# Altium schematic sheet 0166_VCCINAUX_CPU POWER.SchDoc
size 848 x 558 mm
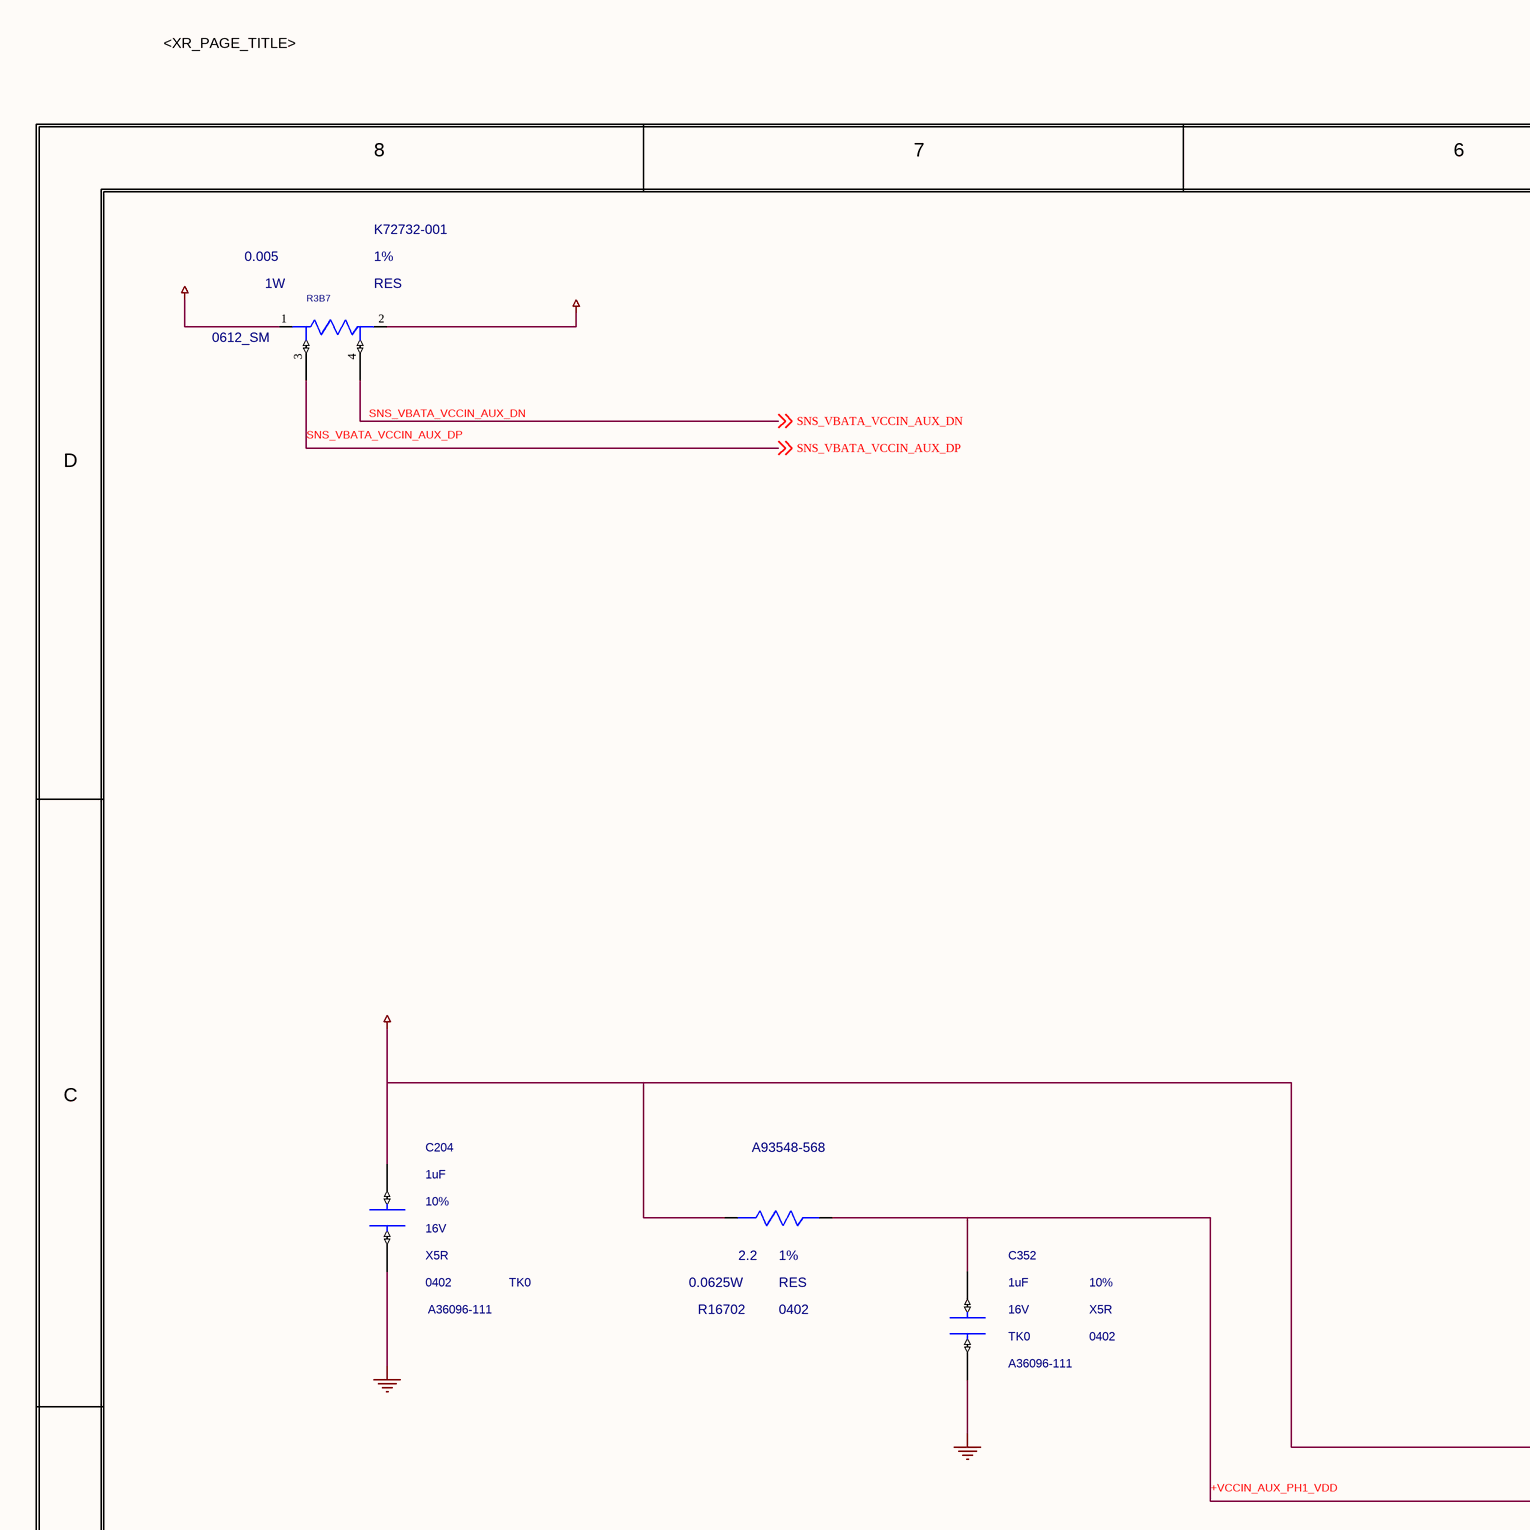
[diagram p0: 0166_VCCINAUX_CPU POWER.SchDoc, top left]
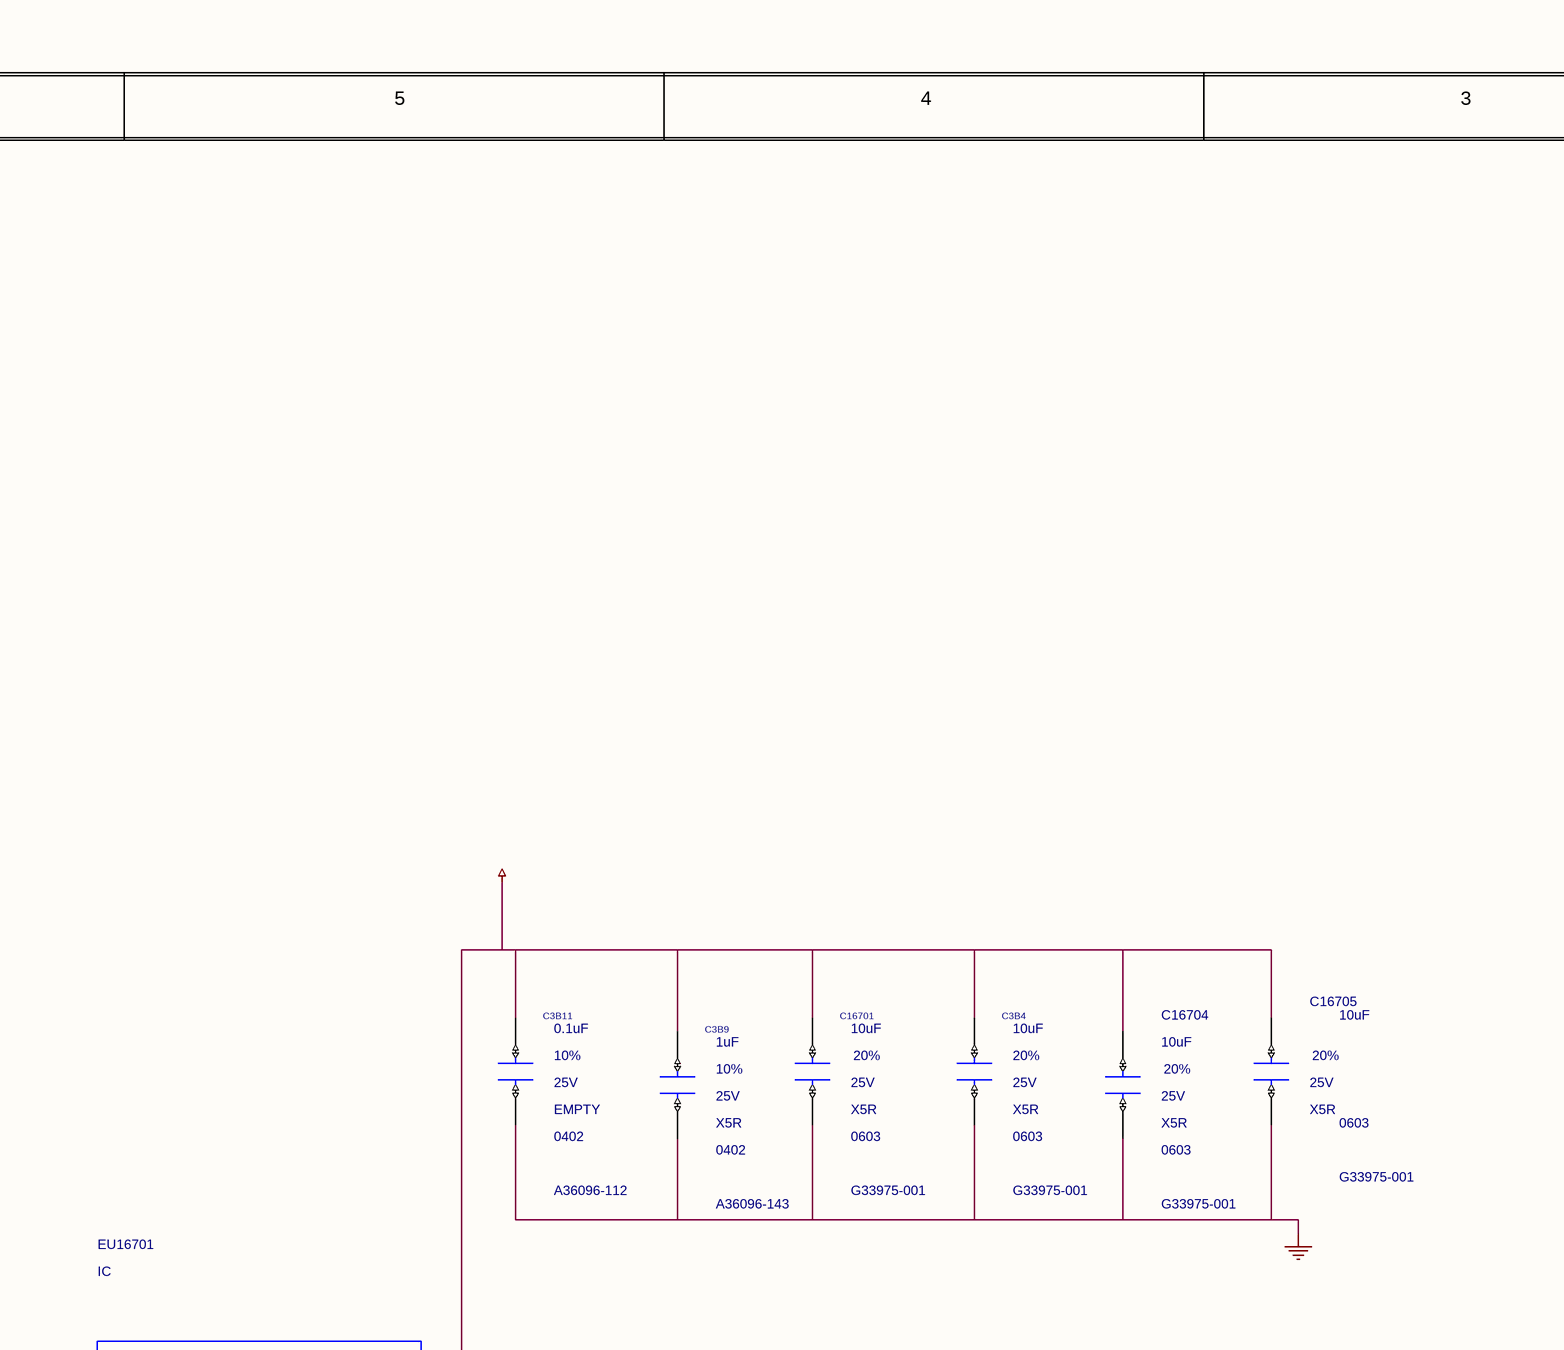
[diagram p1: 0166_VCCINAUX_CPU POWER.SchDoc, top middle]
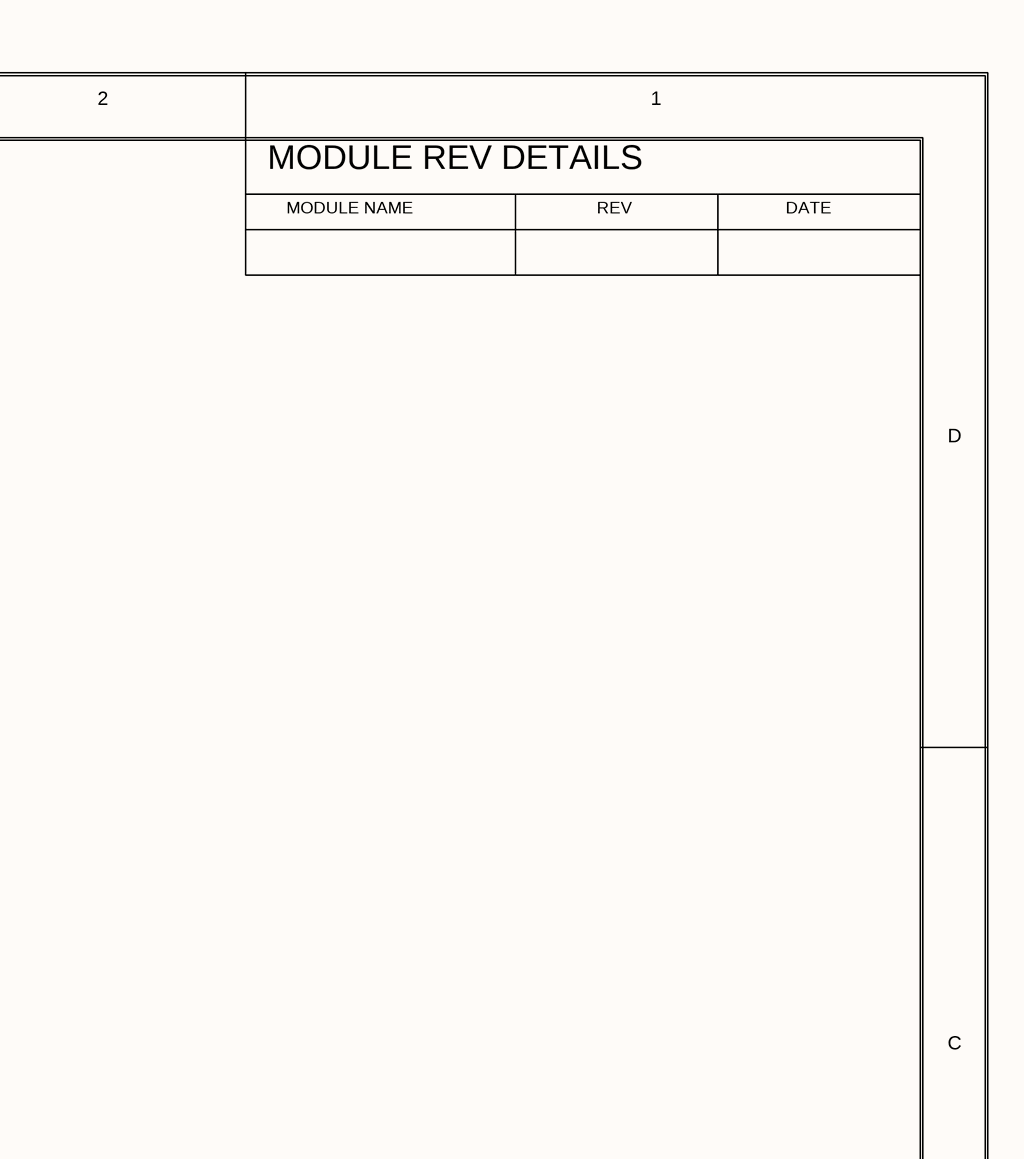
[diagram p2: 0166_VCCINAUX_CPU POWER.SchDoc, top right]
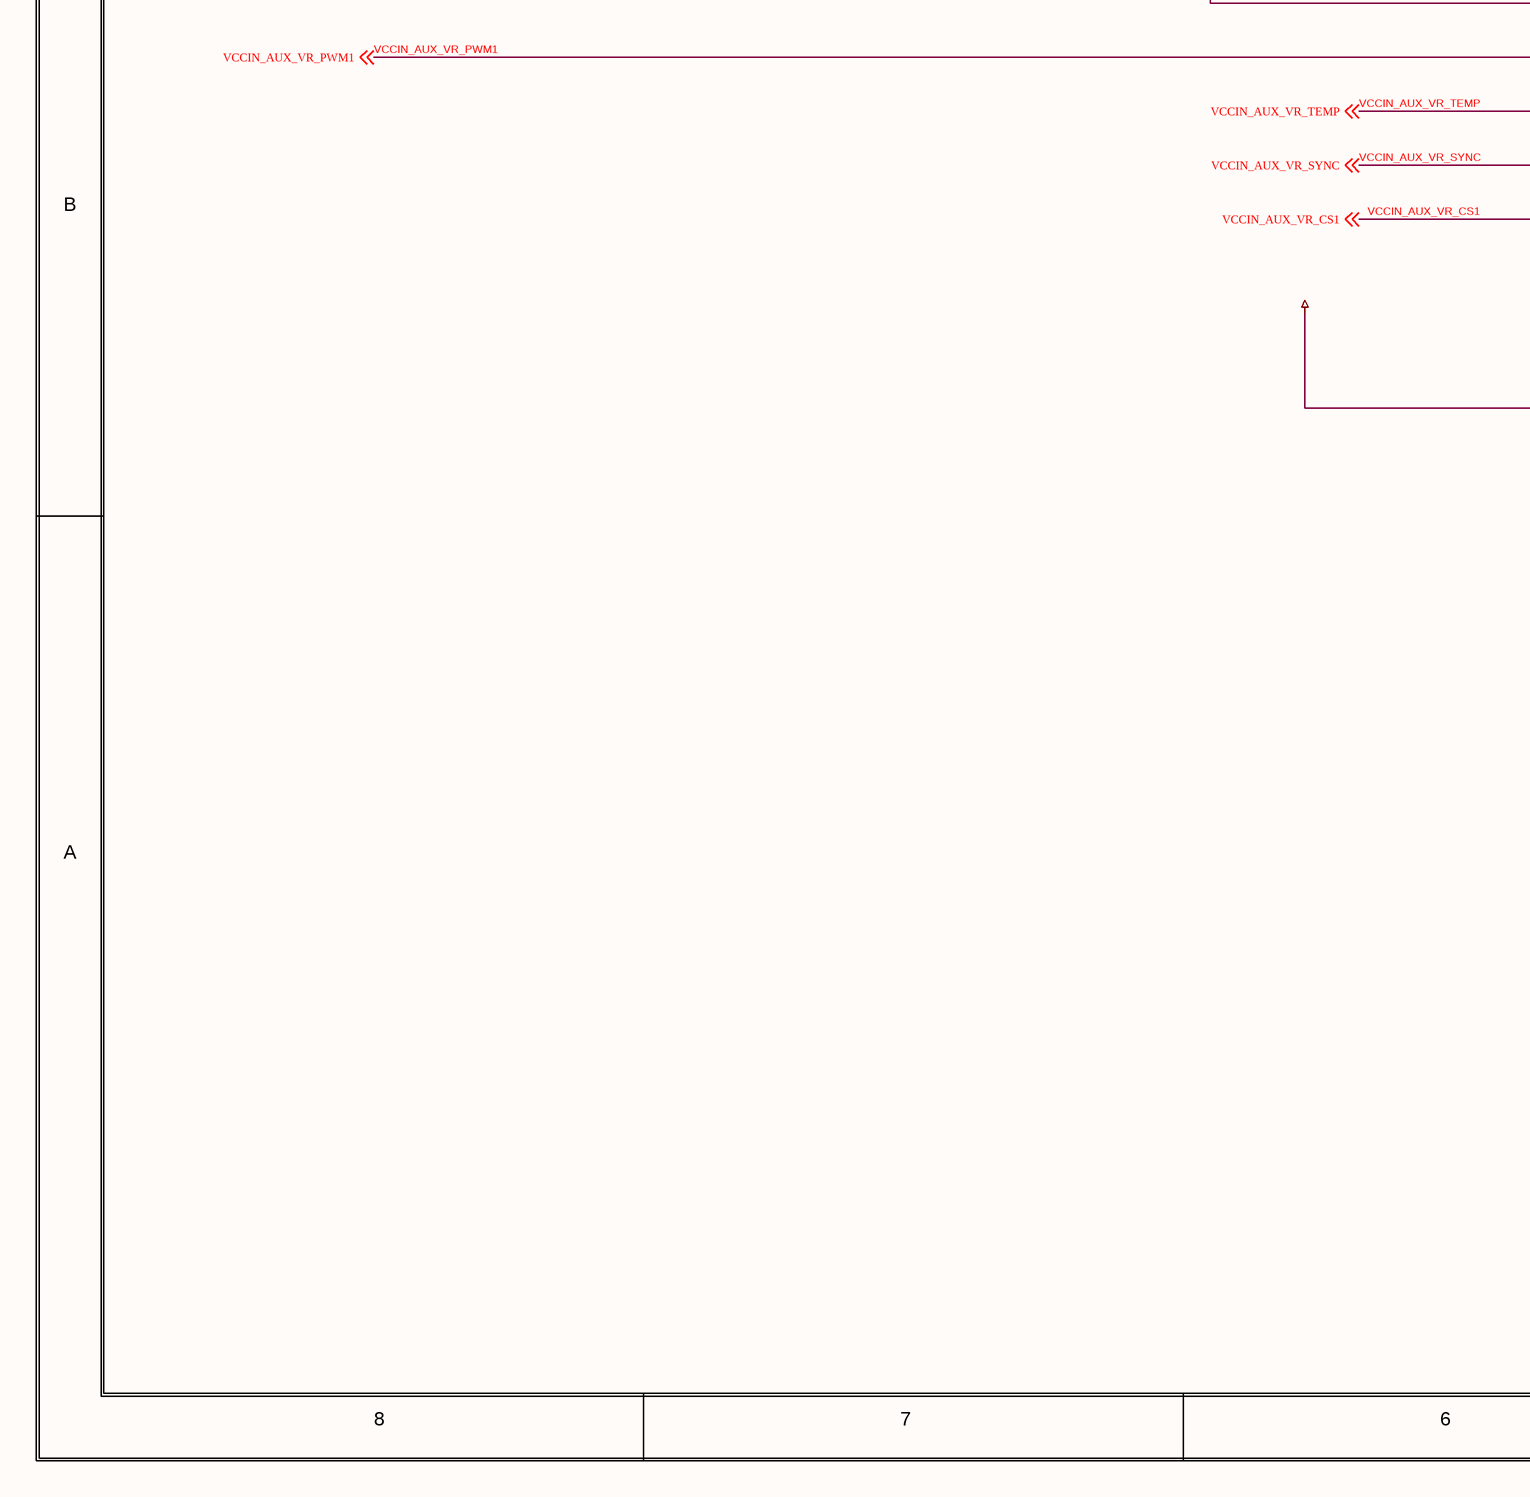
[diagram p3: 0166_VCCINAUX_CPU POWER.SchDoc, bottom left]
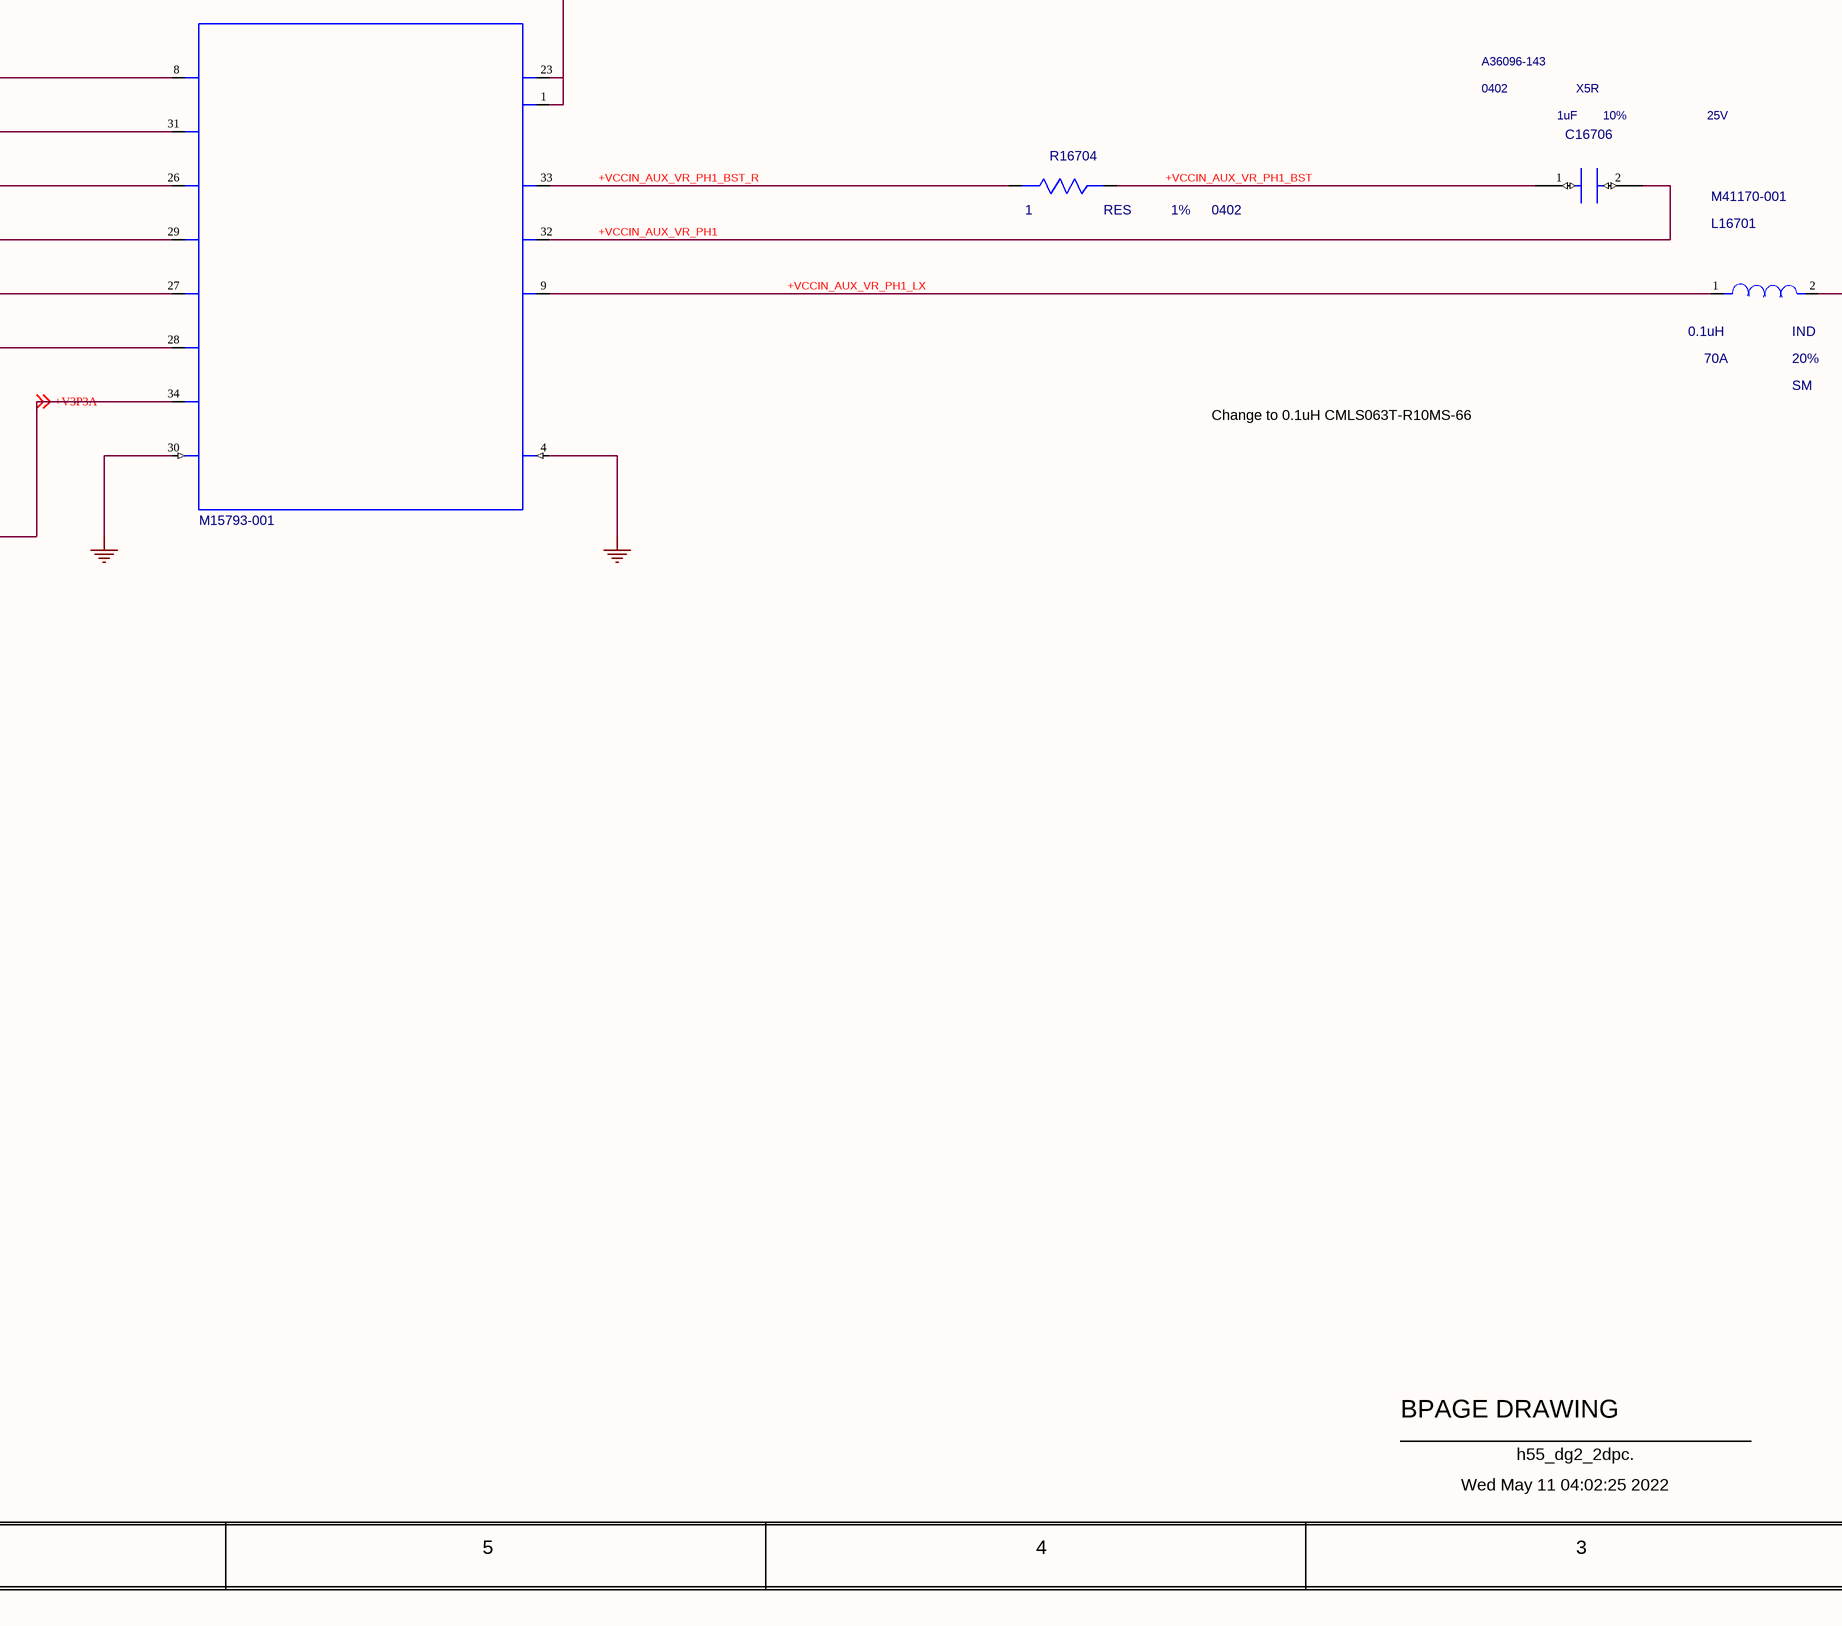
[diagram p4: 0166_VCCINAUX_CPU POWER.SchDoc, bottom middle]
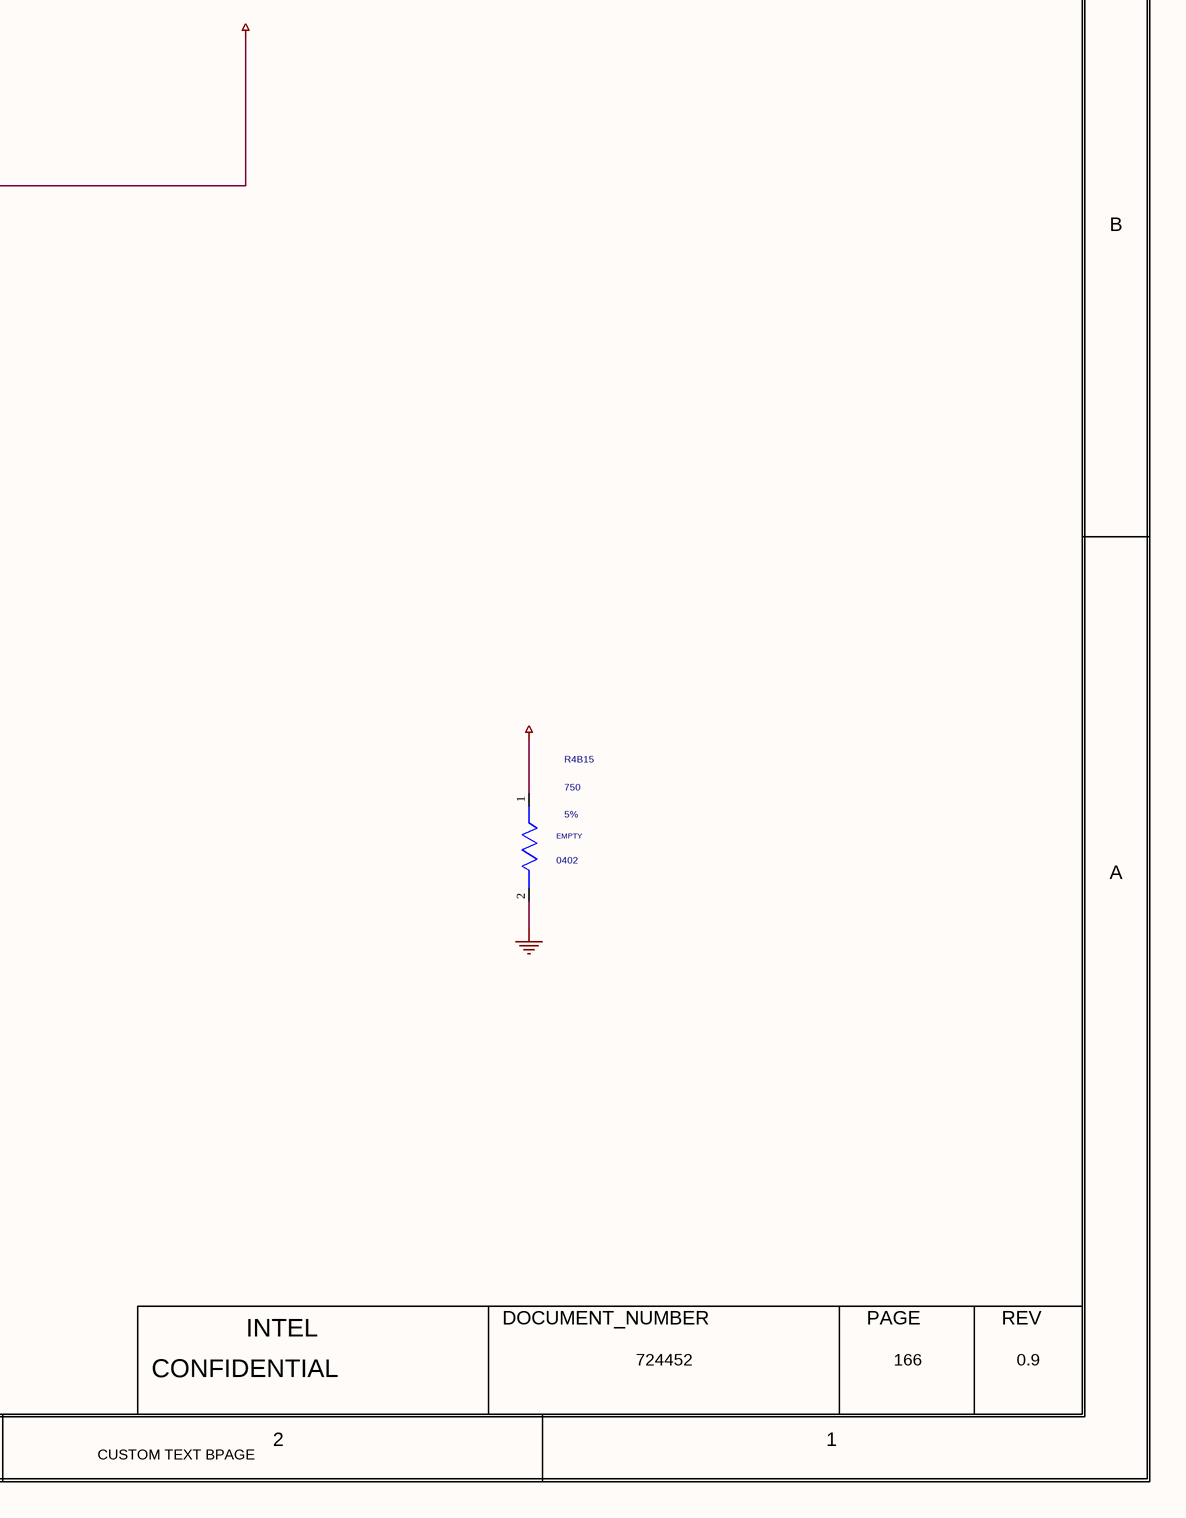
[diagram p5: 0166_VCCINAUX_CPU POWER.SchDoc, bottom right]

## Parts
C3B4  10uF  MATERIAL: X5R  PACK_TYPE: 0603  PART_NUMBER: G33975-001  TOLERANCE: 20%  VOLTAGE: 25V  [CTK2_SM0603_1800X1000_MA]
C3B9  1uF  MATERIAL: X5R  PACK_TYPE: 0402  PART_NUMBER: A36096-143  TOLERANCE: 10%  VOLTAGE: 25V  [CTK2_SM0402_1050X550_MA]
C3B11  0.1uF  MATERIAL: EMPTY  PACK_TYPE: 0402  PART_NUMBER: A36096-112  TOLERANCE: 10%  VOLTAGE: 25V  [CTK0_SM0402_1050X550_MA]
C204  1uF  FP_TECH: TK0  MATERIAL: X5R  PACK_TYPE: 0402  PART_NUMBER: A36096-111  TOLERANCE: 10%  VOLTAGE: 16V  [CTK0_SM0402_1050X550_MA]
C352  1uF  FP_TECH: TK0  MATERIAL: X5R  PACK_TYPE: 0402  PART_NUMBER: A36096-111  TOLERANCE: 10%  VOLTAGE: 16V  [CTK0_SM0402_1050X550_MA]
C16701  10uF  MATERIAL: X5R  PACK_TYPE: 0603  PART_NUMBER: G33975-001  TOLERANCE: 20%  VOLTAGE: 25V  [CTK2_SM0603_1800X1000_MA]
C16704  10uF  MATERIAL: X5R  PACK_TYPE: 0603  PART_NUMBER: G33975-001  TOLERANCE: 20%  VOLTAGE: 25V  [CTK2_SM0603_1800X1000_MA]
C16705  10uF  MATERIAL: X5R  PACK_TYPE: 0603  PART_NUMBER: G33975-001  TOLERANCE: 20%  VOLTAGE: 25V  [CTK2_SM0603_1800X1000_MA]
C16706  1uF  MATERIAL: X5R  PACK_TYPE: 0402  PART_NUMBER: A36096-143  TOLERANCE: 10%  VOLTAGE: 25V  [SMC0402MA]
EU16701  MATERIAL: IC  PART_NUMBER: M15793-001  [CTK1_LCC34_4100X6100_450_DF4P_MA_VR]  (hidden comment: C_MP86959)
L16701  0.1uH  CURRENT: 70A  MATERIAL: IND  PACK_TYPE: SM  PART_NUMBER: M41170-001  TOLERANCE: 20%  [CTK2_SM_7300X6800_MA]
R3B7  0.005  MATERIAL: RES  PACK_TYPE: 0612_SM  PART_NUMBER: K72732-001  TOLERANCE: 1%  WATTAGE: 1W  [CTK0_SMR4_0612_3400X1800_MA_VR]
R4B15  750  MATERIAL: EMPTY  PACK_TYPE: 0402  TOLERANCE: 5%  [SMR0402IA]
R16702  2.2  MATERIAL: RES  PACK_TYPE: 0402  PART_NUMBER: A93548-568  TOLERANCE: 1%  WATTAGE: 0.0625W  [CTK2_SM0402_1100X550_MA]
R16704  1  MATERIAL: RES  PACK_TYPE: 0402  TOLERANCE: 1%  [CTK0_SM0402_1100X550_MA]

## Nets
+V3P3A: C204.1(A) EU16701.8(VDRV) EU16701.34(TEST) R16702.1(A) ; off-sheet +V3P3A
+VBATA: R3B7.1(PWRA)
+VBATA_VCCIN_AUX_VIN: C3B4.1(A) C3B9.1(A) C3B11.1(A) C16701.1(A) C16704.1(A) C16705.1(A) EU16701.1(VIN_1) EU16701.23(VIN_2) R3B7.2(PWRB)
+VCCIN_AUX_PROC: L16701.2(INB) R4B15.1(A)
GND: C3B4.2(B) C3B9.2(B) C3B11.2(B) C204.2(B) C352.2(B) C16701.2(B) C16704.2(B) C16705.2(B) EU16701.4(PGND) EU16701.30(AGND) R4B15.2(B)
+VCCIN_AUX_PH1_VDD: C352.1(A) EU16701.31(VDD) R16702.2(B)
+VCCIN_AUX_VR_PH1: C16706.2(B) EU16701.32(PHASE)
+VCCIN_AUX_VR_PH1_BST: C16706.1(A) R16704.2(B)
+VCCIN_AUX_VR_PH1_BST_R: EU16701.33(BST) R16704.1(A)
+VCCIN_AUX_VR_PH1_LX: EU16701.9(SW) L16701.1(INA)
SNS_VBATA_VCCIN_AUX_DN: R3B7.4(SENB) ; off-sheet SNS_VBATA_VCCIN_AUX_DN
SNS_VBATA_VCCIN_AUX_DP: R3B7.3(SENA) ; off-sheet SNS_VBATA_VCCIN_AUX_DP
VCCIN_AUX_VR_CS1: EU16701.28(CS) ; off-sheet VCCIN_AUX_VR_CS1
VCCIN_AUX_VR_PWM1: EU16701.26(PWM) ; off-sheet VCCIN_AUX_VR_PWM1
VCCIN_AUX_VR_SYNC: EU16701.27(SYNC) ; off-sheet VCCIN_AUX_VR_SYNC
VCCIN_AUX_VR_TEMP: EU16701.29(VTEMP_FLT) ; off-sheet VCCIN_AUX_VR_TEMP

## Notes on the sheet
- <XR_PAGE_TITLE>
- 8
- 7
- 6
- 5
- 4
- 3
- 2
- 1
- MODULE REV DETAILS
- MODULE NAME
- REV
- DATE
- D
- C
- B
- Change to 0.1uH CMLS063T-R10MS-66
- A
- BPAGE DRAWING
- INTEL
- DOCUMENT_NUMBER
- PAGE
- Wed May 11 04:02:25 2022
- h55_dg2_2dpc.
- CONFIDENTIAL
- 724452
- 166
- 0.9
- CUSTOM TEXT BPAGE

## Library data of the parts
C3B4 = C_CAP: CDS_PHYS_PART_NAME: C_CAP_0603-G33975-001,X5R,10UF,25V,20%,TK2,GENERIC; CDS_LMAN_SYM_OUTLINE: -50,50,50,-50; FP_TECH: TK2; IP: GENERIC; ROOM: NONE; OriginalSymbolOrigin: (-50,25); XY: (-9275,4625); VER: 1; ROT: 0; PHYS_PAGE: 166; LOCATION: C3B4; DRAWING: @RVP1_ADL_SB_ADP_S_DDR5_SODIMM_2DPC_LIB.H55_DG2_2DPC(SCH_1):PAGE535; CDS_LIB: c_discrete; VARIANT: ?; PCB Footprint: CTK2_SM0603_1800X1000_MA; CHIPS_PART_NAME: C_CAP; CDS_PART_NAME: C_CAP_0603-G33975-001,X5R,10UF,25V,20%,TK2,GENERIC; CDS_LOCATION: C3B4; ASI_MODEL: G33975-001
C3B9 = C_CAP: CDS_PHYS_PART_NAME: C_CAP_0402-A36096-143,X5R,1UF,25V,10%,TK2,GENERIC; CDS_LMAN_SYM_OUTLINE: -50,50,50,-50; FP_TECH: TK2; IP: GENERIC; ROOM: NONE; OriginalSymbolOrigin: (-50,25); XY: (-9825,4600); VER: 1; ROT: 0; PHYS_PAGE: 166; LOCATION: C3B9; DRAWING: @RVP1_ADL_SB_ADP_S_DDR5_SODIMM_2DPC_LIB.H55_DG2_2DPC(SCH_1):PAGE535; CDS_LIB: c_discrete; VARIANT: ?; PCB Footprint: CTK2_SM0402_1050X550_MA; CHIPS_PART_NAME: C_CAP; CDS_PART_NAME: C_CAP_0402-A36096-143,X5R,1UF,25V,10%,TK2,GENERIC; CDS_LOCATION: C3B9; ASI_MODEL: A36096-143
C3B11 = C_CAP: CDS_PHYS_PART_NAME: C_CAP_0402-A36096-112,EMPTY,0.1UF,25V,10%,TK0,GENERIC; CDS_LMAN_SYM_OUTLINE: -50,50,50,-50; FP_TECH: TK0; IP: GENERIC; ROOM: NONE; OriginalSymbolOrigin: (-50,25); XY: (-10125,4625); VER: 1; ROT: 0; PHYS_PAGE: 166; LOCATION: C3B11; DRAWING: @RVP1_ADL_SB_ADP_S_DDR5_SODIMM_2DPC_LIB.H55_DG2_2DPC(SCH_1):PAGE535; CDS_LIB: c_discrete; VARIANT: ?; PCB Footprint: CTK0_SM0402_1050X550_MA; CHIPS_PART_NAME: C_CAP; CDS_PART_NAME: C_CAP_0402-A36096-112,EMPTY,0.1UF,25V,10%,TK0,GENERIC; CDS_LOCATION: C3B11; ASI_MODEL: A36096-112
C204 = C_CAP: CDS_PHYS_PART_NAME: C_CAP_0402-A36096-111,X5R,1UF,16V,10%,TK0,GENERIC; CDS_LMAN_SYM_OUTLINE: -50,50,50,-50; IP: GENERIC; ROOM: NONE; OriginalSymbolOrigin: (-50,25); XY: (-13325,4450); VER: 1; ROT: 0; PHYS_PAGE: 166; LOCATION: C204; DRAWING: @RVP1_ADL_SB_ADP_S_DDR5_SODIMM_2DPC_LIB.H55_DG2_2DPC(SCH_1):PAGE535; CDS_LIB: c_discrete; VARIANT: ?; PCB Footprint: CTK0_SM0402_1050X550_MA; CHIPS_PART_NAME: C_CAP; CDS_PART_NAME: C_CAP_0402-A36096-111,X5R,1UF,16V,10%,TK0,GENERIC; CDS_LOCATION: C204
C352 = C_CAP: CDS_PHYS_PART_NAME: C_CAP_0402-A36096-111,X5R,1UF,16V,10%,TK0,GENERIC; CDS_LMAN_SYM_OUTLINE: -50,50,50,-50; IP: GENERIC; ROOM: NONE; OriginalSymbolOrigin: (-50,25); XY: (-12250,4250); VER: 1; ROT: 0; PHYS_PAGE: 166; LOCATION: C352; DRAWING: @RVP1_ADL_SB_ADP_S_DDR5_SODIMM_2DPC_LIB.H55_DG2_2DPC(SCH_1):PAGE535; CDS_LIB: c_discrete; VARIANT: ?; PCB Footprint: CTK0_SM0402_1050X550_MA; CHIPS_PART_NAME: C_CAP; CDS_PART_NAME: C_CAP_0402-A36096-111,X5R,1UF,16V,10%,TK0,GENERIC; CDS_LOCATION: C352
C16701 = C_CAP: CDS_PHYS_PART_NAME: C_CAP_0603-G33975-001,X5R,10UF,25V,20%,TK2,GENERIC; CDS_LMAN_SYM_OUTLINE: -50,50,50,-50; FP_TECH: TK2; IP: GENERIC; ROOM: NONE; OriginalSymbolOrigin: (-50,25); XY: (-9575,4625); VER: 1; ROT: 0; PHYS_PAGE: 166; LOCATION: C16701; DRAWING: @RVP1_ADL_SB_ADP_S_DDR5_SODIMM_2DPC_LIB.H55_DG2_2DPC(SCH_1):PAGE535; CDS_LIB: c_discrete; VARIANT: ?; PCB Footprint: CTK2_SM0603_1800X1000_MA; CHIPS_PART_NAME: C_CAP; CDS_PART_NAME: C_CAP_0603-G33975-001,X5R,10UF,25V,20%,TK2,GENERIC; CDS_LOCATION: C16701; ASI_MODEL: G33975-001
C16704 = C_CAP: CDS_PHYS_PART_NAME: C_CAP_0603-G33975-001,X5R,10UF,25V,20%,TK2,GENERIC; CDS_LMAN_SYM_OUTLINE: -50,50,50,-50; FP_TECH: TK2; IP: GENERIC; ROOM: NONE; OriginalSymbolOrigin: (-50,25); XY: (-9000,4600); VER: 1; ROT: 0; PHYS_PAGE: 166; LOCATION: C16704; DRAWING: @RVP1_ADL_SB_ADP_S_DDR5_SODIMM_2DPC_LIB.H55_DG2_2DPC(SCH_1):PAGE535; CDS_LIB: c_discrete; VARIANT: ?; PCB Footprint: CTK2_SM0603_1800X1000_MA; CHIPS_PART_NAME: C_CAP; CDS_PART_NAME: C_CAP_0603-G33975-001,X5R,10UF,25V,20%,TK2,GENERIC; CDS_LOCATION: C16704; ASI_MODEL: G33975-001
C16705 = C_CAP: CDS_PHYS_PART_NAME: C_CAP_0603-G33975-001,X5R,10UF,25V,20%,TK2,GENERIC; CDS_LMAN_SYM_OUTLINE: -50,50,50,-50; FP_TECH: TK2; IP: GENERIC; ROOM: NONE; OriginalSymbolOrigin: (-50,25); XY: (-8725,4625); VER: 1; ROT: 0; PHYS_PAGE: 166; LOCATION: C16705; DRAWING: @RVP1_ADL_SB_ADP_S_DDR5_SODIMM_2DPC_LIB.H55_DG2_2DPC(SCH_1):PAGE535; CDS_LIB: c_discrete; VARIANT: ?; PCB Footprint: CTK2_SM0603_1800X1000_MA; CHIPS_PART_NAME: C_CAP; CDS_PART_NAME: C_CAP_0603-G33975-001,X5R,10UF,25V,20%,TK2,GENERIC; CDS_LOCATION: C16705; ASI_MODEL: G33975-001
C16706 = CAP#1: CHIPS_PART_NAME: CAP; CDS_PHYS_PART_NAME: CAP_0402-A36096-143,X5R,1UF,25V,10%,LPDB,GENERIC; OriginalSymbolOrigin: (-25,50); XY: (-8325,3825); VER: 2; ROT: 0; PHYS_PAGE: 166; LOCATION: C16706; DRAWING: @RVP1_ADL_SB_ADP_S_DDR5_SODIMM_2DPC_LIB.H55_DG2_2DPC(SCH_1):PAGE535; CDS_LIB: discrete; PCB Footprint: SMC0402MA; CDS_PART_NAME: CAP_0402-A36096-143,X5R,1UF,25V,10%,LPDB,GENERIC; CDS_LOCATION: C16706
EU16701 = C_MP86959: CDS_PHYS_PART_NAME: C_MP86959_LCC-M15793-001,IC,MP86959GMW,TK1,GENERIC; CDS_LMAN_SYM_OUTLINE: -300,450,300,-450; FP_TECH: TK1; IP: GENERIC; PACK_TYPE: LCC; ROOM: NONE; OriginalSymbolOrigin: (-325,450); XY: (-10600,3675); VER: 1; ROT: 0; PHYS_PAGE: 166; LOCATION: EU16701; DRAWING: @RVP1_ADL_SB_ADP_S_DDR5_SODIMM_2DPC_LIB.H55_DG2_2DPC(SCH_1):PAGE535; CDS_LIB: local; VARIANT: ?; PCB Footprint: CTK1_LCC34_4100X6100_450_DF4P_MA_VR; CHIPS_PART_NAME: C_MP86959; CDS_PART_NAME: C_MP86959_LCC-M15793-001,IC,MP86959GMW,TK1,GENERIC; CDS_LOCATION: EU16701
L16701 = C_INDUCTOR: CDS_PHYS_PART_NAME: C_INDUCTOR_SM-M41170-001,IND,0.1UH,20%,70A,TK2,GENERIC; CDS_LMAN_SYM_OUTLINE: -100,50,100,-50; FP_TECH: TK2; IP: GENERIC; ROOM: NONE; OriginalSymbolOrigin: (-75,25); XY: (-8000,3625); VER: 1; ROT: 0; PHYS_PAGE: 166; LOCATION: L16701; DRAWING: @RVP1_ADL_SB_ADP_S_DDR5_SODIMM_2DPC_LIB.H55_DG2_2DPC(SCH_1):PAGE535; CDS_LIB: local; VARIANT: ?; PCB Footprint: CTK2_SM_7300X6800_MA; CHIPS_PART_NAME: C_INDUCTOR; CDS_PART_NAME: C_INDUCTOR_SM-M41170-001,IND,0.1UH,20%,70A,TK2,GENERIC; CDS_LOCATION: L16701
R3B7 = C_RES_4TERM: CDS_PHYS_PART_NAME: C_RES_4TERM_0612_SM-K72732-001,RES,0.005,1%,1W,TK0,GENERIC; CDS_LMAN_SYM_OUTLINE: -50,50,50,-50; FP_TECH: TK0; IP: GENERIC; ROOM: NONE; OriginalSymbolOrigin: (-75,25); XY: (-13425,6100); VER: 1; ROT: 0; PHYS_PAGE: 166; LOCATION: R3B7; DRAWING: @RVP1_ADL_SB_ADP_S_DDR5_SODIMM_2DPC_LIB.H55_DG2_2DPC(SCH_1):PAGE535; CDS_LIB: c_discrete; VARIANT: ?; PCB Footprint: CTK0_SMR4_0612_3400X1800_MA_VR; CHIPS_PART_NAME: C_RES_4TERM; CDS_PART_NAME: C_RES_4TERM_0612_SM-K72732-001,RES,0.005,1%,1W,TK0,GENERIC; CDS_LOCATION: R3B7; ASI_MODEL: K72732-001
R4B15 = RES: PART_NUMBER: A36093-015; CDS_PHYS_PART_NAME: RES_0402-A36093-015,EMPTY,750,5%,1/16W,LPDB,GENERIC; WATTAGE: 1/16W; OriginalSymbolOrigin: (-25,75); XY: (-6875,2400); VER: 2; ROT: 0; PHYS_PAGE: 166; LOCATION: R4B15; IP: GENERIC; FP_TECH: LPDB; DRAWING: @RVP1_ADL_SB_ADP_S_DDR5_SODIMM_2DPC_LIB.H55_DG2_2DPC(SCH_1):PAGE535; CDS_LIB: discrete; PCB Footprint: SMR0402IA; CHIPS_PART_NAME: RES; CDS_PART_NAME: RES_0402-A36093-015,EMPTY,750,5%,1/16W,LPDB,GENERIC; CDS_LOCATION: R4B15; ASI_MODEL: A36093-015
R16702 = C_RES#1: CHIPS_PART_NAME: C_RES; CDS_PHYS_PART_NAME: C_RES_0402-A93548-568,RES,2.2,1%,0.0625W,TK2,GENERIC; CDS_LMAN_SYM_OUTLINE: -50,50,50,-50; FP_TECH: TK2; IP: GENERIC; ROOM: NONE; OriginalSymbolOrigin: (-75,25); XY: (-12600,4450); VER: 1; ROT: 0; PHYS_PAGE: 166; LOCATION: R16702; DRAWING: @RVP1_ADL_SB_ADP_S_DDR5_SODIMM_2DPC_LIB.H55_DG2_2DPC(SCH_1):PAGE535; CDS_LIB: c_discrete; VARIANT: ?; PCB Footprint: CTK2_SM0402_1100X550_MA; CDS_PART_NAME: C_RES_0402-A93548-568,RES,2.2,1%,0.0625W,TK2,GENERIC; CDS_LOCATION: R16702
R16704 = C_RES#1: PART_NUMBER: A93548-210; CHIPS_PART_NAME: C_RES; CDS_PHYS_PART_NAME: C_RES_0402-A93548-210,RES,1,1%,0.0625W,TK0,GENERIC; CDS_LMAN_SYM_OUTLINE: -50,50,50,-50; FP_TECH: TK0; IP: GENERIC; ROOM: NONE; WATTAGE: 0.0625W; OriginalSymbolOrigin: (-75,25); XY: (-9300,3825); ROT: 0; PHYS_PAGE: 166; LOCATION: R16704; DRAWING: @RVP1_ADL_SB_ADP_S_DDR5_SODIMM_2DPC_LIB.H55_DG2_2DPC(SCH_1):PAGE535; CDS_LIB: c_discrete; VARIANT: ?; PCB Footprint: CTK0_SM0402_1100X550_MA; VER: 1; CDS_PART_NAME: C_RES_0402-A93548-210,RES,1,1%,0.0625W,TK0,GENERIC; CDS_LOCATION: R16704